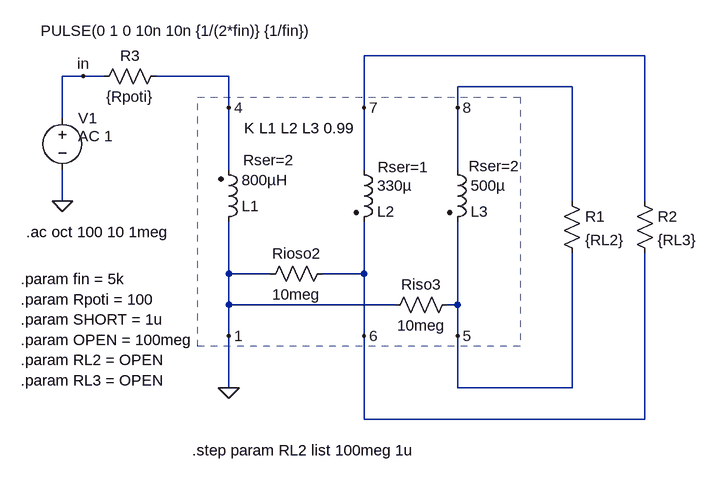
[diagram p0: schematic trafe_L_übertrager.asc]
trafe_L_übertrager.asc, the LTspice schematic file:
Version 4
SHEET 1 880 680
WIRE 480 -288 48 -288
WIRE -384 -256 -416 -256
WIRE -352 -256 -384 -256
WIRE -160 -256 -272 -256
WIRE 368 -240 192 -240
WIRE -160 -208 -160 -256
WIRE 48 -208 48 -288
WIRE 192 -208 192 -240
WIRE -416 -192 -416 -256
WIRE -160 -112 -160 -208
WIRE 48 -112 48 -208
WIRE 192 -112 192 -208
WIRE -416 -64 -416 -112
WIRE 368 -64 368 -240
WIRE 480 -64 480 -288
WIRE -160 48 -160 -32
WIRE -96 48 -160 48
WIRE 48 48 48 -32
WIRE 48 48 -16 48
WIRE -160 96 -160 48
WIRE 96 96 -160 96
WIRE 192 96 192 -32
WIRE 192 96 176 96
WIRE -160 144 -160 96
WIRE 48 144 48 48
WIRE 192 144 192 96
WIRE -160 224 -160 144
WIRE 192 224 192 144
WIRE 368 224 368 16
WIRE 368 224 192 224
WIRE 48 272 48 144
WIRE 480 272 480 16
WIRE 480 272 48 272
FLAG -416 -64 0
FLAG -384 -256 in
FLAG -160 -208 4
FLAG -160 144 1
FLAG 48 -208 7
FLAG 192 -208 8
FLAG 192 144 5
FLAG 48 144 6
FLAG -160 224 0
SYMBOL ind2 -176 -16 M180
WINDOW 39 38 111 Left 2
SYMATTR InstName L1
SYMATTR Value 800µH
SYMATTR Type ind
SYMATTR SpiceLine Rser=2
SYMBOL ind2 32 -128 R0
WINDOW 0 36 80 Left 2
WINDOW 3 36 40 Left 2
WINDOW 39 37 12 Left 2
SYMATTR InstName L2
SYMATTR Value 330µ
SYMATTR Type ind
SYMATTR SpiceLine Rser=1
SYMBOL ind2 176 -128 R0
WINDOW 0 36 80 Left 2
WINDOW 3 36 40 Left 2
WINDOW 39 33 10 Left 2
SYMATTR InstName L3
SYMATTR Value 500µ
SYMATTR Type ind
SYMATTR SpiceLine Rser=2
SYMBOL res 192 80 R90
WINDOW 0 0 56 VBottom 2
WINDOW 3 32 56 VTop 2
SYMATTR InstName Riso3
SYMATTR Value 10meg
SYMBOL res 0 32 R90
WINDOW 0 0 56 VBottom 2
WINDOW 3 32 56 VTop 2
SYMATTR InstName Rioso2
SYMATTR Value 10meg
SYMBOL res -256 -272 R90
WINDOW 0 0 56 VBottom 2
WINDOW 3 32 56 VTop 2
SYMATTR InstName R3
SYMATTR Value {Rpoti}
SYMBOL res 352 -80 R0
SYMATTR InstName R1
SYMATTR Value {RL2}
SYMBOL res 464 -80 R0
SYMATTR InstName R2
SYMATTR Value {RL3}
SYMBOL voltage -416 -208 R0
WINDOW 3 -33 -118 Left 2
WINDOW 123 24 44 Left 2
WINDOW 39 0 0 Left 2
SYMATTR InstName V1
SYMATTR Value PULSE(0 1 0 10n 10n {1/(2*fin)} {1/fin})
SYMATTR Value2 AC 1
TEXT -136 -176 Left 2 !K L1 L2 L3 0.99
TEXT -472 -16 Left 2 !.ac oct 100 10 1meg
TEXT -480 56 Left 2 !.param fin = 5k\n.param Rpoti = 100\n.param SHORT = 1u\n.param OPEN = 100meg\n.param RL2 = OPEN\n.param RL3 = OPEN
TEXT -216 320 Left 2 !.step param RL2 list 100meg 1u
RECTANGLE Normal 288 160 -208 -224 2

The netlist it stands for:
* trafe_L_übertrager.asc
L1 0 4 800µH Rser=2
L2 7 6 330µ Rser=1
L3 8 5 500µ Rser=2
Riso3 5 0 10meg
Rioso2 6 0 10meg
R3 4 in {Rpoti}
R1 8 5 {RL2}
R2 7 6 {RL3}
V1 in 0 PULSE(0 1 0 10n 10n {1/(2*fin)} {1/fin}) AC 1
K L1 L2 L3 0.99
.ac oct 100 10 1meg
.param fin = 5k
.param Rpoti = 100
.param SHORT = 1u
.param OPEN = 100meg
.param RL2 = OPEN
.param RL3 = OPEN
.step param RL2 list 100meg 1u
.backanno
.end